# Altium project RocketFPGA.PrjPcb
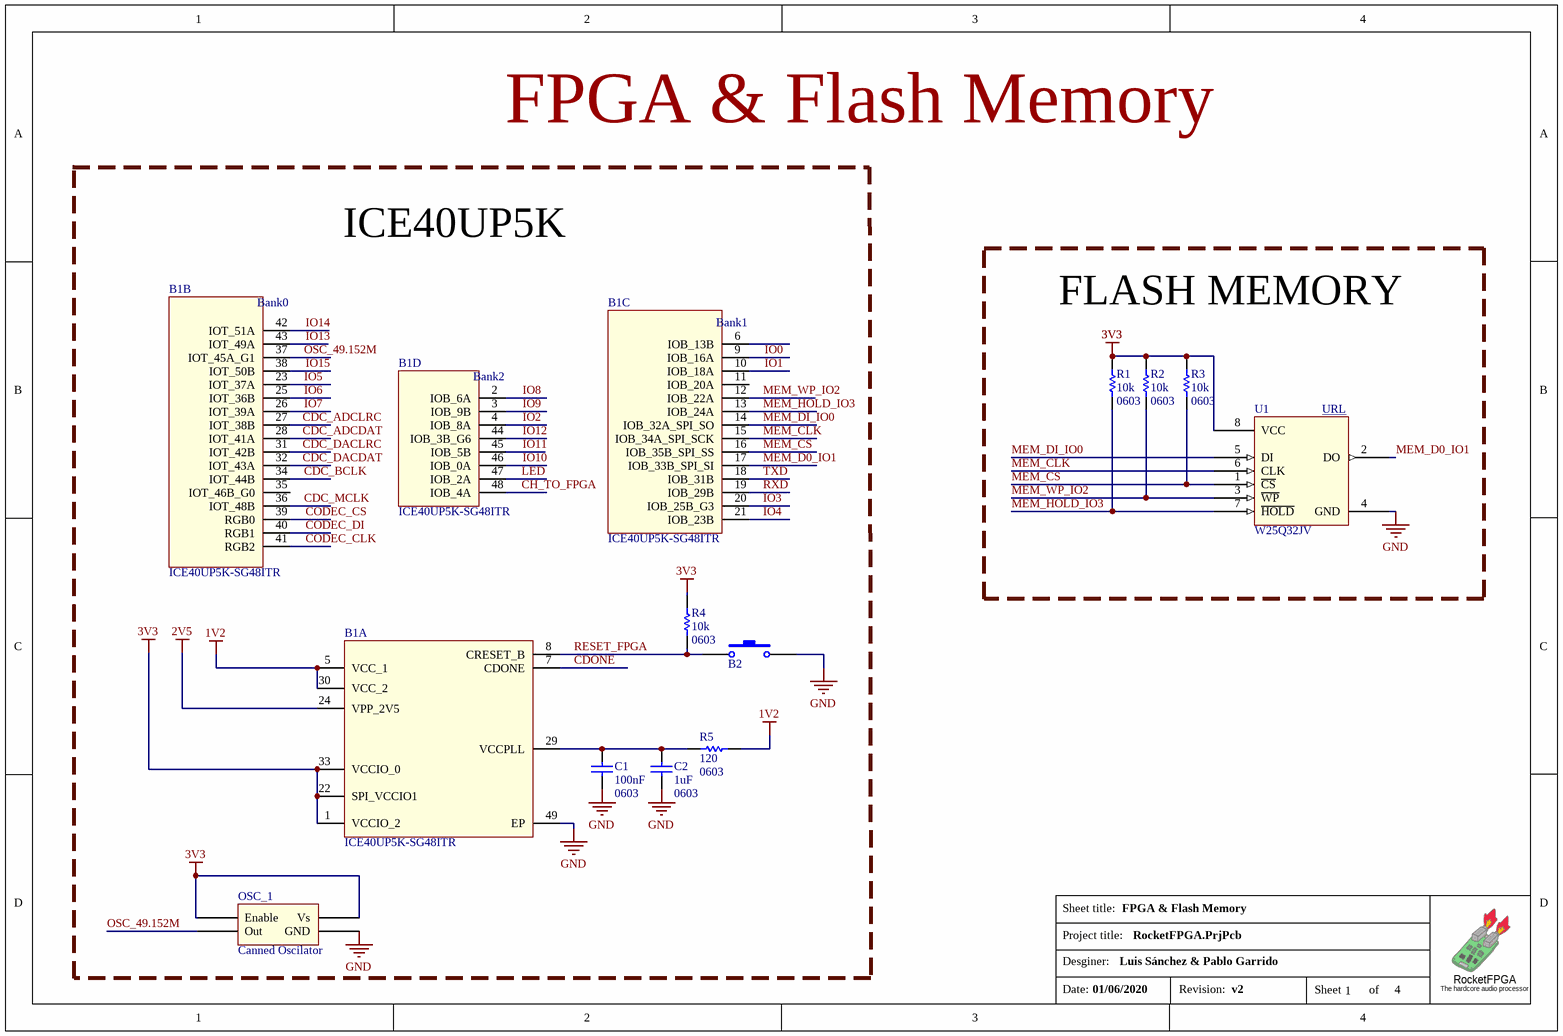
[diagram p0: 01_FPGA_FlashMem.SchDoc]
author_name: Luis Sánchez & Pablo Garrido; release_date: 01/06/2020; revision_no: v2
1 sheet, 11 parts. Net scope: global (net labels, ports and power ports of the same name join across sheets).
Board files: panel.PcbDoc, RocketFPGA.PcbDoc

## Sheet 01_FPGA_FlashMem.SchDoc: FPGA & Flash Memory
size A4; Date: 08/06/2019; Author: Luis Sánchez Velasco; DocumentNumber: 1; Revision: 0; SheetNumber: 1; SheetTotal: 4; sheet_title: FPGA & Flash Memory

### Parts
B1  ICE40UP5K-SG48ITR  [QFN50P700X700X100-49N-D]  (parts A,B,C,D of 4)
B2  FSM6JH  [SMD_PUSHBUTTON_3x6x2mm5]  (value not drawn)
C1  value 100nF  Package: 0603  [0603 CAP]  (hidden comment: Ceramic capacitor)
C2  value 1uF  Package: 0603  [0603 CAP]  (hidden comment: Ceramic capacitor)
OSC_1  Canned Oscilator  [canned oscillator small]
R1  value 10k  Package: 0603  [Resistencia 0603]  (hidden comment: Resistor)
R2  value 10k  Package: 0603  [Resistencia 0603]  (hidden comment: Resistor)
R3  value 10k  Package: 0603  [Resistencia 0603]  (hidden comment: Resistor)
R4  value 10k  Package: 0603  [Resistencia 0603]  (hidden comment: Resistor)
R5  value 120  Package: 0603  [Resistencia 0603]  (hidden comment: Resistor)
U1  W25Q32JV  [W25Q32J]

### Blocks framed on the sheet
ICE40UP5K: B1 B2 C1 C2 OSC_1 R4 R5
FLASH MEMORY: R1-R3 U1

### Nets
1V2: B1.5(VCC_1) B1.30(VCC_2) R5.2
2V5: B1.24(VPP_2V5)
3V3: B1.1(VCCIO_2) B1.22(SPI_VCCIO1) B1.33(VCCIO_0) OSC_1.1(Enable) OSC_1.4(Vs) R1.2 R2.2 R3.2 R4.2 U1.8(VCC)
GND: B1.49(EP) B2.2 C1.1 C2.1 OSC_1.2(GND) U1.4(GND)
CDC_ADCDAT: B1.28(IOT_41A)
CDC_ADCLRC: B1.27(IOT_38B)
CDC_BCLK: B1.34(IOT_44B)
CDC_DACDAT: B1.32(IOT_43A)
CDC_DACLRC: B1.31(IOT_42B)
CDC_MCLK: B1.36(IOT_48B)
CDONE: B1.7(CDONE)
CH_TO_FPGA: B1.48(IOB_4A)
CODEC_CLK: B1.41(RGB2)
CODEC_CS: B1.39(RGB0)
CODEC_DI: B1.40(RGB1)
IO0: B1.9(IOB_16A)
IO1: B1.10(IOB_18A)
IO2: B1.4(IOB_8A)
IO3: B1.20(IOB_25B_G3)
IO4: B1.21(IOB_23B)
IO5: B1.23(IOT_37A)
IO6: B1.25(IOT_36B)
IO7: B1.26(IOT_39A)
IO8: B1.2(IOB_6A)
IO9: B1.3(IOB_9B)
IO10: B1.46(IOB_0A)
IO11: B1.45(IOB_5B)
IO12: B1.44(IOB_3B_G6)
IO13: B1.43(IOT_49A)
IO14: B1.42(IOT_51A)
IO15: B1.38(IOT_50B)
LED: B1.47(IOB_2A)
MEM_CLK: B1.15(IOB_34A_SPI_SCK) U1.6(CLK)
MEM_CS: B1.16(IOB_35B_SPI_SS) R3.1 U1.1(~{CS})
MEM_D0_IO1: B1.17(IOB_33B_SPI_SI) U1.2(DO)
MEM_DI_IO0: B1.14(IOB_32A_SPI_SO) U1.5(DI)
MEM_HOLD_IO3: B1.13(IOB_24A) R1.1 U1.7(~{HOLD})
MEM_WP_IO2: B1.12(IOB_22A) R2.1 U1.3(~{WP})
OSC_49.152M: B1.37(IOT_45A_G1) OSC_1.3(Out)
RESET_FPGA: B1.8(CRESET_B) B2.1 R4.1
RXD: B1.19(IOB_29B)
TXD: B1.18(IOB_31B)
NetB1_29: B1.29(VCCPLL) C1.2 C2.2 R5.1

Not connected (* = marked no-connect by the designer): B1 6(IOB_13B) 11(IOB_20A) 35(IOT_46B_G0)

### Notes on the sheet
- FPGA & Flash Memory
- (near U1) URL <https://eu.mouser.com/ProductDetail/STMicroelectronics/M95M02-DWMN3TP-K?qs=sGAEpiMZZMuVhdAcoizlRYly6JnwLZjJGi2czB2d%252bG8%3d>
- Sheet title:
- Project title:
- Desginer:
- The hardcore audio processor
- RocketFPGA
- Date:
- Revision:
- Sheet
- of
- (in symbol ICE40UP5K-SG48ITR, part B) Bank0
- (in symbol ICE40UP5K-SG48ITR, part C) Bank1
- (in symbol ICE40UP5K-SG48ITR, part D) Bank2

### Library data of the parts
B1 = ICE40UP5K-SG48ITR: FPGA - Field Programmable Gate Array iCE40-UltraPlus, 5280 LUTs, 1.2V; Vendor: Mouser; Link: https://www.mouser.es/ProductDetail/Lattice/ICE40UP5K-SG48I?qs=Rp3RbKSfAt3UqOG1AN4%2FAg%3D%3D
B2 = FSM6JH: Button THT Switch; vendor: Mouser; vendorID: 611-PTS636SL43SMTRLF; Supplier 1: Mouser; Supplier Part Number 1: 506-FSM6JH; price: 0.096
C1 = Capacitor: vendor: LCSC; vendorID: 0603F104M500NT; Supplier 1: Mouser; Supplier Part Number 1: 80-C1206C104K5R; ManufacturerReference: -; price: 0.0023
C2 = Capacitor: vendor: LCSC; vendorID: CC0603ZRY5V7BB105; Supplier 1: Mouser; Supplier Part Number 1: 80-C1206C104K5R; ManufacturerReference: -; price: 0.0053
OSC_1 = Canned Oscilator: Canned Oscilator -LFSPXO019116BULK; Vendor: LCSC; Link: https://lcsc.com/product-detail/SMD-Oscillators-XO_Shenzhen-SCTF-Elec-S3D49-152000B20F30T_C387443.html
R1-R4 = Resistor: vendor: LCSC; vendorID: 0603WAF1002T5E; Supplier 1: Farnell; Supplier Part Number 1: 2358436; ManufacturerReference: -; price: 0.0009
  R1: Parameter 1: *
R5 = Resistor: vendor2: vendor; vendor: LCSC; vendorID: CR0603FA1200G; Supplier 1: Farnell; Supplier Part Number 1: 2358436; ManufacturerReference: -; price: 0.0024
U1 = W25Q32JV: 32M-BIT SERIAL FLASH MEMORY WITH DUAL AND QUAD SPI; Vendor: LCSC; Link: https://lcsc.com/product-detail/FLASH_Winbond-Elec-W25Q32JVSSIQ_C82344.html